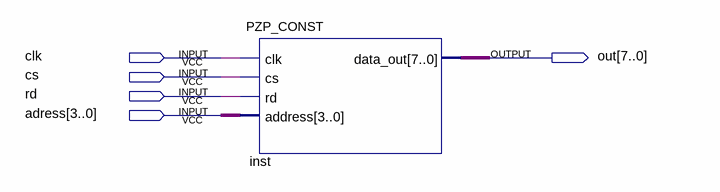
[diagram p0: schematic sheet]
// Quartus schematic Block1.bdf as structural Verilog: 1 symbols, 5 pins
module Block1 (
  input  clk,
  input  cs,
  input  rd,
  input  [3:0] adress,
  output [7:0] out
);

  PZP_CONST inst (.clk(clk), .cs(cs), .rd(rd), .address(adress), .data_out(out));
endmodule
